# EAGLE design LabDuino (EAGLE 7.2.0)
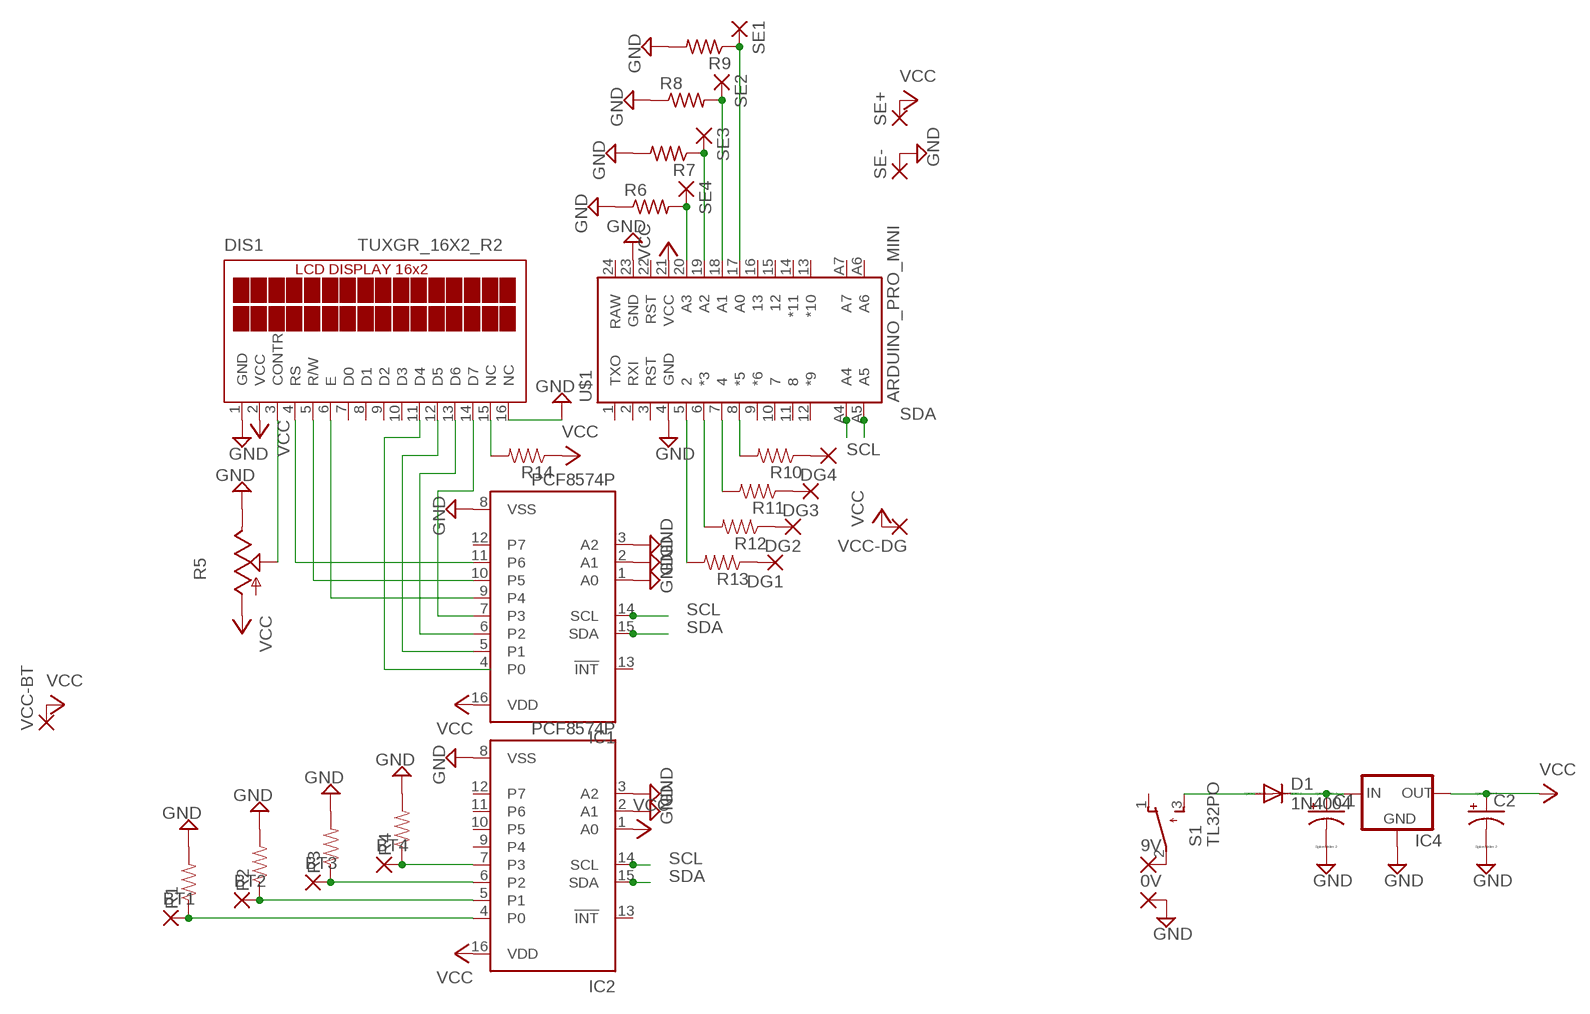
[diagram p0: schematic, sheet 1]

## Parts
0V  2,54/1,1  [2,54/1,1]
9V  2,54/1,1  [2,54/1,1]
BT1  1,6/0,9  [1,6/0,9]
BT2  1,6/0,9  [1,6/0,9]
BT3  1,6/0,9  [1,6/0,9]
BT4  1,6/0,9  [1,6/0,9]
C1  CPOL-USE2-4  [E2-4]
C2  CPOL-USE2-4  [E2-4]
D1  1N4004  [DO41-10]
DG1  1,6/0,9  [1,6/0,9]
DG2  1,6/0,9  [1,6/0,9]
DG3  1,6/0,9  [1,6/0,9]
DG4  1,6/0,9  [1,6/0,9]
DIS1  TUXGR_16X2_R2  [TUXGR_16X2_R2]
IC1  PCF8574P  [DIL16]
IC2  PCF8574P  [DIL16]
IC4  V_REG_78XX-TO-220  [TO-220-ALT]
R1  RESISTORPTH-1/6W  [1/6W-RES]
R2  RESISTORPTH-1/6W  [1/6W-RES]
R3  RESISTORPTH-1/6W  [1/6W-RES]
R4  RESISTORPTH-1/6W  [1/6W-RES]
R5  TRIM_US-RS3  [RS3]
R6  R-US_0204/7  [0204/7]
R7  R-US_0204/7  [0204/7]
R8  R-US_0204/7  [0204/7]
R9  R-US_0204/7  [0204/7]
R10  RESISTORPTH-1/6W  [1/6W-RES]
R11  RESISTORPTH-1/6W  [1/6W-RES]
R12  RESISTORPTH-1/6W  [1/6W-RES]
R13  RESISTORPTH-1/6W  [1/6W-RES]
R14  RESISTORPTH-1/6W  [1/6W-RES]
S1  TL32PO  [TL3XPO]
SE1  1,6/0,9  [1,6/0,9]
SE2  1,6/0,9  [1,6/0,9]
SE3  1,6/0,9  [1,6/0,9]
SE4  1,6/0,9  [1,6/0,9]
SE+  1,6/0,9  [1,6/0,9]
SE-  1,6/0,9  [1,6/0,9]
U$1  ARDUINO_PRO_MINI  [ARDUINO_PRO_MINI]
VCC-BT  1,6/0,9  [1,6/0,9]
VCC-DG  1,6/0,9  [1,6/0,9]

## Nets
10K: BT2.1(P) IC2.5(P1) R2.1
GND: 0V.1(P) C1.- C2.- DIS1.1(GND) DIS1.16(NC) IC1.1(A0) IC1.2(A1) IC1.3(A2) IC1.8(VSS) IC2.2(A1) IC2.3(A2) IC2.8(VSS) IC4.GND R1.2 R2.2 R3.2 R4.2 R5.E R6.1 R7.2 R8.1 R9.2 SE-.1(P) U$1.4(GND) U$1.23(GND)
N$1: R6.2 SE4.1(P) U$1.20(A3)
N$2: BT1.1(P) IC2.4(P0) R1.1
N$3: 9V.1(P) S1.2(P)
N$4: BT3.1(P) IC2.6(P2) R3.1
N$5: BT4.1(P) IC2.7(P3) R4.1
N$6: R7.1 SE3.1(P) U$1.19(A2)
N$7: DIS1.4(RS) IC1.11(P6)
N$8: DIS1.5(R/W) IC1.10(P5)
N$9: DIS1.6(E) IC1.9(P4)
N$10: DIS1.14(D7) IC1.7(P3)
N$11: DIS1.13(D6) IC1.6(P2)
N$12: DIS1.12(D5) IC1.5(P1)
N$13: DIS1.11(D4)
N$14: DIS1.3(CONTR) R5.S
N$15: D1.A S1.3(S)
N$16: C1.+ D1.C IC4.IN
N$17: R8.2 SE2.1(P) U$1.18(A1)
N$18: R9.1 SE1.1(P) U$1.17(A0)
N$19: R13.2 U$1.5
N$20: R12.2 U$1.6(*3)
N$21: R11.2 U$1.7
N$22: R10.2 U$1.8(*5)
N$23: DG1.1(P) R13.1
N$24: DG2.1(P) R12.1
N$25: DG3.1(P) R11.1
N$26: DG4.1(P) R10.1
N$27: DIS1.15(NC) R14.2
SCL: IC1.14(SCL) IC2.14(SCL) U$1.A4
SDA: IC1.15(SDA) IC2.15(SDA) U$1.A5
VCC: C2.+ DIS1.2(VCC) IC1.16(VDD) IC2.1(A0) IC2.16(VDD) IC4.OUT R5.A R14.1 SE+.1(P) U$1.21(VCC) VCC-BT.1(P) VCC-DG.1(P)
Unconnected: DIS1.7(D0) DIS1.8(D1) DIS1.9(D2) DIS1.10(D3) IC1.4(P0) IC1.12(P7) IC1.13(!INT) IC2.9(P4) IC2.10(P5) IC2.11(P6) IC2.12(P7) IC2.13(!INT) S1.1(O) U$1.1(TXO) U$1.2(RXI) U$1.3(RST) U$1.9(*6) U$1.10 U$1.11 U$1.12(*9) U$1.13(*10) U$1.14(*11) U$1.15 U$1.16 U$1.22(RST) U$1.24(RAW) U$1.A6 U$1.A7

## Library data of the parts
0V 9V = wirepad:2,54/1,1: THROUGH-HOLE PAD
BT1-BT4 DG1-DG4 SE1-SE4 SE+ SE- VCC-BT VCC-DG = wirepad:1,6/0,9: THROUGH-HOLE PAD
C1 C2 = resistor:CPOL-US: POLARIZED CAPACITOR, American symbol
D1 = diode:1N4004: DIODE general purpose rectifier, 1 A
DIS1 = display-lcd:TUXGR_16X2_R2: Tuxgraphics LCD display 16x2 characters reflective, without background light Source: tuxgr_12x2_r2.pdf; OC_FARNELL: unknown; OC_NEWARK: unknown
IC1 IC2 = micro-philips:PCF8574: I2C-Bus Remote 8-bit I/O expander http://www.semiconductors.philips.com/acrobat_download/datasheets/PCF8574_4.pdf; MPN: PCF8574PN; OC_FARNELL: 204020; OC_NEWARK: 11N8515
IC4 = SparkFun-PowerIC:V_REG_78XX: Voltage Regulator Standard 78xx regulator. IGO (Input Ground Output). Spark Fun Electronics SKU : COM-00107
R1-R4 R10-R14 = SparkFun-Resistors:RESISTOR: Resistor Basic schematic elements and footprints for 0603, 1206, and PTH resistors.
R5 = pot:TRIM_US-: POTENTIOMETER
R6-R9 = resistor:R-US_: RESISTOR, American symbol
S1 = switch:TL32PO: TINY SWITCH ON - MOM Source: http://www2.produktinfo.conrad.com/datenblaetter/700000-724999/705152-da-01-de-Subminiaturschalter_TL_36YO.pdf
U$1 = SparkFun-Boards:ARDUINO_PRO_MINI

## Net classes
0 default: width 0.254 mm, drill 0.381 mm, clearance 0.508 mm

## Board
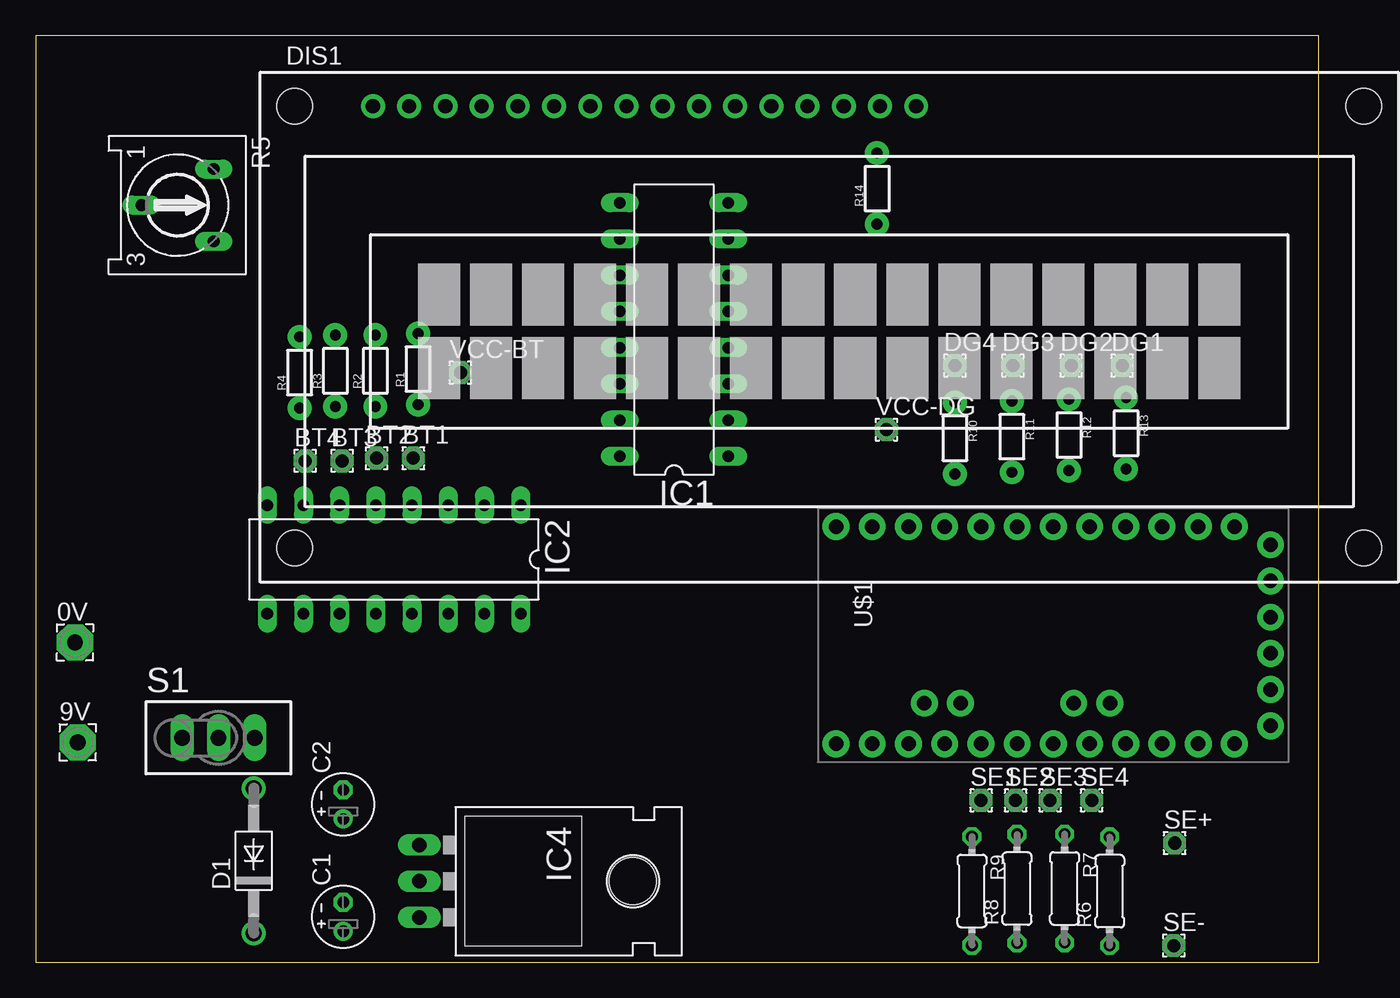
[diagram p1: board, top side]
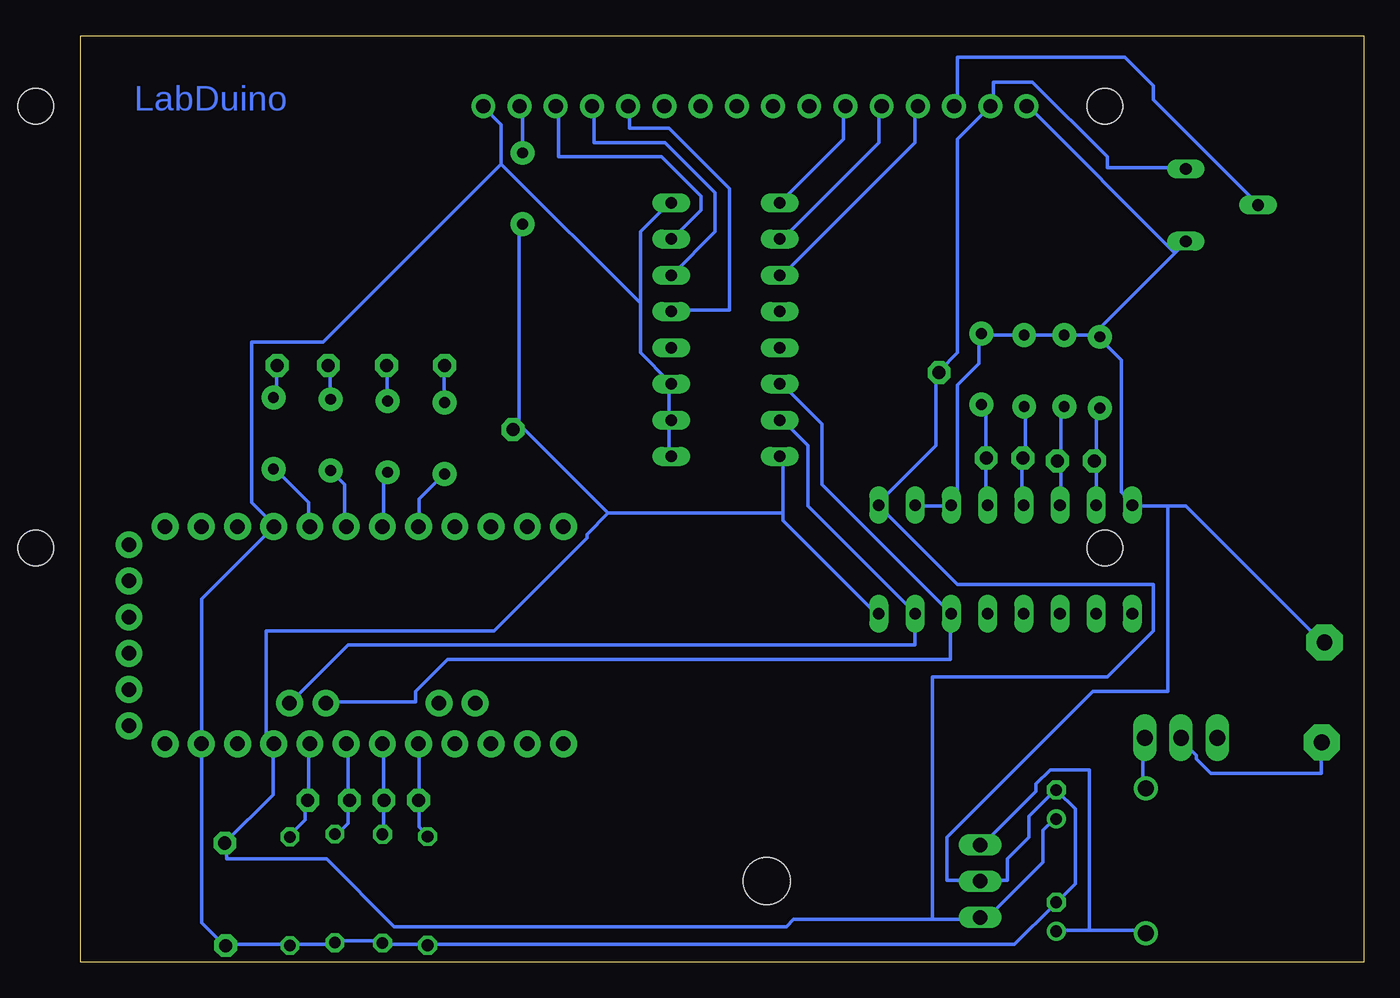
[diagram p2: board, bottom side, seen from below]

Size 90 x 65 mm. Coordinates in mm from the lower left corner, seen from the top.
Outline: 0,0 90,0 90,65 0,65 0,0
Copper layers (1*16): Top 0.035mm / dielectric 1.5mm / Bottom 0.035mm
Design rules "default": minimum track width 10mil, minimum drill 24mil, track to track 8mil, track to pad 8mil, pad to pad 8mil, via to via 8mil, smd to smd 8mil, copper to edge 40mil, drill to drill 8mil, minimum pad ring 10mil, minimum via ring 8mil, stop-mask expansion 4mil, vias tented up to drill 0mil, thermal gap 10mil

### Footprints (pad centres in the part's own frame; a part is rotated, then mirrored left to right if it is on the bottom)
2,54/1,1 = drill 1.118 pad 2.54 octagon: 1 0,0
1,6/0,9 = drill 0.914 pad 1.6 octagon: 1 0,0
E2-4 = drill 0.813 pad 1.27: + -1.016,0 | drill 0.813 pad 1.27 octagon: - 1.016,0
DO41-10 = drill 1.118: A 5.08,0; C -5.08,0
TUXGR_16X2_R2 = drill 1 pad 1.676: 1 -32,15.5; 2 -29.46,15.5; 3 -26.92,15.5; 4 -24.38,15.5; 5 -21.84,15.5; 6 -19.3,15.5; 7 -16.76,15.5; 8 -14.22,15.5; 9 -11.68,15.5; 10 -9.14,15.5; 11 -6.6,15.5; 12 -4.06,15.5; 13 -1.52,15.5; 14 1.02,15.5; 15 3.56,15.5; 16 6.1,15.5 | hole 2.5: -37.5,-15.5; 37.5,-15.5; -37.5,15.5; 37.5,15.5
DIL16 = drill 0.813 long: 1 -8.89,-3.81; 2 -6.35,-3.81; 3 -3.81,-3.81; 4 -1.27,-3.81; 5 1.27,-3.81; 6 3.81,-3.81; 7 6.35,-3.81; 8 8.89,-3.81; 9 8.89,3.81; 10 6.35,3.81; 11 3.81,3.81; 12 1.27,3.81; 13 -1.27,3.81; 14 -3.81,3.81; 15 -6.35,3.81; 16 -8.89,3.81
TO-220-ALT = drill 1.016 long: GND 0,-3.81; IN -2.54,-3.81; OUT 2.54,-3.81 | hole 3.302: 0,11.176
1/6W-RES = drill 0.762 pad 1.676: 1 -2.5,0; 2 2.5,0
RS3 = drill 0.813 long: A -2.54,2.54; E 2.54,2.54; S 0,-2.54
0204/7 = drill 0.813 octagon: 1 -3.81,0; 2 3.81,0
TL3XPO = drill 1.1 pad 1.422 long: 1 -2.54,0; 2 0,0; 3 2.54,0
ARDUINO_PRO_MINI = drill 1.016 pad 1.88: 1 -7.62,12.7; 2 -7.62,10.16; 3 -7.62,7.62; 4 -7.62,5.08; 5 -7.62,2.54; 6 -7.62,0; 7 -7.62,-2.54; 8 -7.62,-5.08; 9 -7.62,-7.62; 10 -7.62,-10.16; 11 -7.62,-12.7; 12 -7.62,-15.24; 13 7.62,-15.24; 14 7.62,-12.7; 15 7.62,-10.16; 16 7.62,-7.62; 17 7.62,-5.08; 18 7.62,-2.54; 19 7.62,0; 20 7.62,2.54; 21 7.62,5.08; 22 7.62,7.62; 23 7.62,10.16; 24 7.62,12.7; A4 4.763,1.429; A5 4.763,3.969; A6 4.763,-9.049; A7 4.763,-6.509; BLK -6.35,15.24; GND -3.81,15.24; GRN 6.35,15.24; RXI 1.27,15.24; TXO 3.81,15.24; VCC -1.27,15.24

### Placement (x,y rotation side)
0V  2.76,22.43 0 top
9V  2.95,15.43 0 top
BT1  26.49,35.36 0 top
BT2  23.91,35.36 0 top
BT3  21.49,35.17 0 top
BT4  18.91,35.17 0 top
C1  21.57,3.19 90 top
C2  21.57,11.07 90 top
D1  15.3,7.12 90 top
DG1  76.21,41.86 0 top
DG2  72.63,41.86 0 top
DG3  68.55,41.86 0 top
DG4  64.47,41.86 0 top
DIS1  55.66,44.55 0 top
IC1  44.78,44.38 90 top
IC2  25.13,28.26 180 top
IC4  30.72,5.68 270 top
R1  26.83,41.61 90 top
R2  23.83,41.49 90 top
R3  21.02,41.49 90 top
R4  18.52,41.37 90 top
R5  9.95,53.11 270 top
R6  75.33,4.98 90 top
R7  72.17,5.18 270 top
R8  68.83,5.16 90 top
R9  65.67,5 270 top
R10  64.48,36.75 270 top
R11  68.48,36.87 270 top
R12  72.48,36.99 270 top
R13  76.48,37.11 270 top
R14  59.02,54.27 90 top
S1  12.82,15.74 0 top
SE1  66.31,11.36 0 top
SE2  68.73,11.36 0 top
SE3  71.15,11.36 0 top
SE4  74.07,11.36 0 top
SE+  79.89,8.36 0 top
SE-  79.83,1.17 0 top
U$1  71.38,22.94 270 top
VCC-BT  29.79,41.36 0 top
VCC-DG  59.68,37.36 0 top

### Tracks (layer width: path | path; a pad name or v marks a point on that pad's centre or on a via)
10K
  Bottom 0.254: IC2.5 24,32.25 24,35.25 BT2.1 23.75,35.5 23.75,38.75 R2.1
GND
  Bottom 0.254: IC2.2 31.25,32 29,32 IC2.3 28.75,32.25 28.5,32.5 28.5,40.5 27,42 27,44 R1.2 26.75,44 24,44 R2.2 23.75,44 21.25,44 R3.2 21,44 18.75,44 R4.2 | R4.2 18.5,43.75 17,42.25 17,33 16.25,32.25 IC2.8 16,32 13.75,32 | 13.25,49.75 18.5,44.5 18.5,44 R4.2 | 13.25,49.75 12.5,50.5 R5.E | 13.25,49.75 23.5,60 DIS1.1 | 13.75,32 12.5,32 3,22.5 0V.1 | 13.75,32 13.75,19 19,19 29.25,8.75 29.25,5.75 27,5.75 IC4.GND 26.75,5.75 25,5.75 25,7.25 23.5,8.75 23.5,10.25 21.75,12 C2.- 21.5,12 20.25,10.75 20.25,5.5 21.5,4.25 C1.- 21.75,4 24.5,1.25 65.5,1.25 R9.2 65.75,1.25 68.75,1.25 R8.1 69,1.5 72,1.5 R7.2 72.25,1.25 75.25,1.25 R6.1 75.5,1.25 79.75,1.25 SE-.1 80,1.25 81.5,2.75 81.5,15.25 U$1.23 81.5,15.5 81.5,25.5 76.5,30.5 U$1.4 76.5,30.75 78,32.25 78,43.5 73,43.5 60.5,56 | IC1.1 48.75,35.5 48.75,38 IC1.2 48.75,38.25 48.75,40.5 IC1.3 48.75,40.75 50.75,42.75 50.75,46.25 | 50.75,46.25 50.75,51.25 48.75,53.25 IC1.8 | 60.5,56 60.5,58.75 61.75,60 DIS1.16 | 50.75,46.25 60.5,56
N$1
  Bottom 0.254: R6.2 75.25,9 74.25,10 74.25,11.25 SE4.1 74,11.5 74,15.25 U$1.20
N$2
  Bottom 0.254: IC2.4 26.5,32.25 26.5,35.25 BT1.1 26.5,35.5 26.5,38.75 26.75,39 R1.1
N$3
  Bottom 0.254: S1.2 12.75,15.5 11.75,14.5 11.75,14.25 10.75,13.25 3,13.25 3,15.25 9V.1
N$4
  Bottom 0.254: IC2.6 21.25,32.25 21.25,35 BT3.1 21.25,35.25 21.25,38.75 R3.1
N$5
  Bottom 0.254: IC2.7 18.75,32.25 18.75,35 BT4.1 18.75,35.25 18.75,38.75 R4.1
N$6
  Bottom 0.254: R7.1 72,9 71.25,9.75 71.25,11.25 SE3.1 71.25,11.5 71.25,15.25 U$1.19
N$7
  Bottom 0.254: IC1.11 40.75,48.25 31.5,57.5 31.5,60 DIS1.4
N$8
  Bottom 0.254: IC1.10 40.75,50.75 34,57.5 34,60 DIS1.5
N$9
  Bottom 0.254: IC1.9 40.75,53.5 36.5,57.75 36.5,60 DIS1.6
N$10
  Bottom 0.254: IC1.7 48.5,50.75 46.5,52.75 46.5,53.75 49.25,56.5 56.5,56.5 56.5,60 DIS1.14
N$11
  Bottom 0.254: IC1.6 48.5,48.25 45.5,51.25 45.5,54 49,57.5 54,57.5 54,60 DIS1.13
N$12
  Bottom 0.254: IC1.5 48.5,45.75 44.5,45.75 44.5,54.25 48.75,58.5 51.5,58.5 51.5,60 DIS1.12
N$14
  Bottom 0.254: R5.S 7.5,53.25 14.75,60.5 14.75,61.5 16.75,63.5 28.5,63.5 28.5,60.25 DIS1.3
N$15
  Bottom 0.254: S1.3 15.5,15.5 15.5,12.25 D1.A
N$16
  Bottom 0.254: 19.25,2.25 15.5,2.25 D1.C | 19.25,2.25 21.5,2.25 C1.+ | 19.25,2.25 19.25,13.5 22,13.5 23,12.5 23,12 26.75,8.25 IC4.IN
N$17
  Bottom 0.254: R8.2 68.75,9 68.75,11.25 SE2.1 68.75,11.5 68.75,15.25 U$1.18
N$18
  Bottom 0.254: R9.1 65.75,9 66.25,9.5 66.25,11.25 SE1.1 66.25,11.5 66.25,15.25 U$1.17
N$19
  Bottom 0.254: R13.2 76.25,34.5 74,32.25 74,30.75 U$1.5
N$20
  Bottom 0.254: R12.2 72.25,34.25 71.5,33.5 71.5,30.75 U$1.6
N$21
  Bottom 0.254: R11.2 68.5,34.25 68.75,34 68.75,30.75 U$1.7
N$22
  Bottom 0.254: R10.2 64.5,34.25 66.25,32.5 66.25,30.75 U$1.8
N$23
  Bottom 0.254: DG1.1 76.25,41.75 76.25,39.75 R13.1
N$24
  Bottom 0.254: DG2.1 72.5,41.75 72.5,39.5 R12.1
N$25
  Bottom 0.254: DG3.1 68.5,41.75 68.5,39.5 R11.1
N$26
  Bottom 0.254: DG4.1 64.5,41.75 64.5,39.25 R10.1
N$27
  Bottom 0.254: R14.2 59,57 59,60 DIS1.15
SCL
  Bottom 0.254: IC1.14 40.75,40.5 38,37.75 38,33.5 29,24.5 IC2.14 29,24.25 29,21.25 64.25,21.25 66.5,19 66.5,18.25 72.75,18.25 U$1.A4
SDA
  Bottom 0.254: IC1.15 40.75,38 39,36.25 39,32 31.5,24.5 IC2.15 31.5,24.25 31.5,22.25 71.25,22.25 75.25,18.25 U$1.A5
VCC
  Bottom 0.254: 59.25,37.75 59.5,37.5 VCC-DG.1 59.25,37.75 | 59.25,37.75 59.25,51.75 R14.1 | 40.75,31.5 40.75,35.25 IC1.16 | 40.75,31.5 40.75,31 34.25,24.5 IC2.16 | 53,31.5 59.25,37.75 | 40.75,31.5 53,31.5 | R5.A 12.5,55.75 18,55.75 18,56.5 23.25,61.75 26,61.75 26,60.25 DIS1.2 28.5,57.75 28.5,42.75 29.75,41.5 VCC-BT.1 30,41.25 30,36.25 34,32.25 IC2.1 34,32 28.5,26.5 14.75,26.5 14.75,23.25 18,20 30.25,20 30.25,3 | C2.+ 21.75,10 22.5,9.25 22.5,7 26.25,3.25 26.75,3.25 IC4.OUT 27,3 30.25,3 | 30.25,3 40,3 40.5,2.5 68,2.5 72.75,7.25 79.75,7.25 79.75,8.25 SE+.1 76.5,11.75 76.5,15.25 U$1.21 76.5,15.5 77,16 77,23.25 61,23.25 54.5,29.75 54.5,30 53,31.5

### Text on the board
Bottom: LabDuino